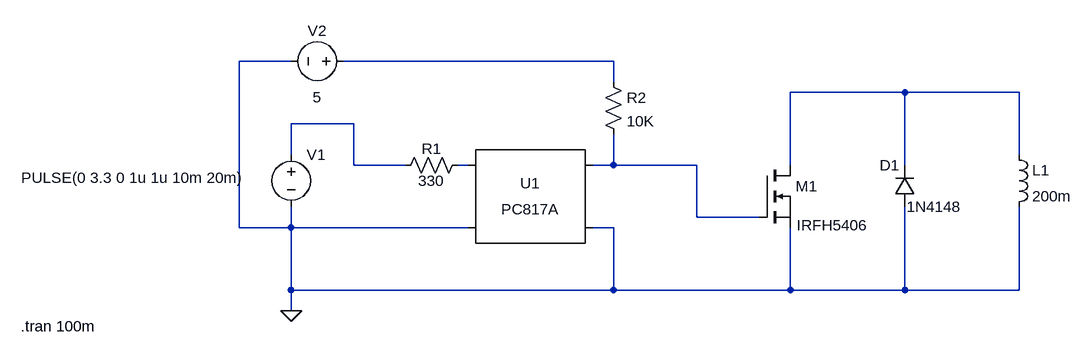
[diagram p0: schematic Schalt_sim.asc]
Schalt_sim.asc, the LTspice schematic file:
Version 4.1
SHEET 1 1200 680
WIRE 0 16 -80 16
WIRE 496 16 80 16
WIRE 496 48 496 16
WIRE 944 64 768 64
WIRE 1120 64 944 64
WIRE 96 112 0 112
WIRE 0 160 0 112
WIRE 1120 160 1120 64
WIRE 96 176 96 112
WIRE 176 176 96 176
WIRE 272 176 256 176
WIRE 496 176 496 128
WIRE 496 176 464 176
WIRE 624 176 496 176
WIRE 768 176 768 64
WIRE 944 176 944 64
WIRE 624 256 624 176
WIRE 720 256 624 256
WIRE -80 272 -80 16
WIRE 0 272 0 240
WIRE 0 272 -80 272
WIRE 272 272 0 272
WIRE 496 272 464 272
WIRE 0 368 0 272
WIRE 496 368 496 272
WIRE 496 368 0 368
WIRE 768 368 768 272
WIRE 768 368 496 368
WIRE 944 368 944 240
WIRE 944 368 768 368
WIRE 1120 368 1120 240
WIRE 1120 368 944 368
WIRE 0 400 0 368
FLAG 0 400 0
SYMBOL voltage 0 144 R0
WINDOW 3 -415 51 Left 2
WINDOW 123 0 0 Left 0
WINDOW 39 0 0 Left 0
SYMATTR InstName V1
SYMATTR Value PULSE(0 3.3 0 1u 1u 10m 20m)
SYMBOL voltage 96 16 R90
WINDOW 0 -31 56 VBottom 2
WINDOW 3 40 56 VTop 2
WINDOW 123 0 0 Left 0
WINDOW 39 0 0 Left 0
SYMATTR InstName V2
SYMATTR Value 5
SYMBOL Optos\\PC817A 368 224 R0
SYMATTR InstName U1
SYMBOL res 160 192 R270
WINDOW 0 26 56 VTop 2
WINDOW 3 8 56 VBottom 2
SYMATTR InstName R1
SYMATTR Value 330
SYMBOL res 480 32 R0
SYMATTR InstName R2
SYMATTR Value 10K
SYMBOL diode 960 240 R180
WINDOW 0 24 64 Left 2
WINDOW 3 -72 0 Left 2
SYMATTR InstName D1
SYMATTR Value 1N4148
SYMBOL nmos 720 176 R0
WINDOW 3 58 92 Left 2
SYMATTR InstName M1
SYMATTR Value IRFH5406
SYMBOL ind 1104 144 R0
SYMATTR InstName L1
SYMATTR Value 200m
SYMATTR SpiceLine Ipk=0.1 Rser=50
TEXT -416 424 Left 2 !.tran 100m

The netlist it stands for:
* Schalt_sim.asc
V1 N003 0 PULSE(0 3.3 0 1u 1u 10m 20m)
V2 N001 0 5
X§U1 N004 0 N005 0 PC817 Igain=1m
R1 N003 N004 330
R2 N001 N005 10K
D1 0 N002 1N4148
M1 N002 N005 0 0 IRFH5406
L1 N002 0 200m Ipk=0.1 Rser=50
.model D D
.lib standard.dio
.model NMOS NMOS
.model PMOS PMOS
.lib standard.mos
.tran 100m
.lib PC817.sub
.backanno
.end